# EAGLE schematic LED-Schematic (EAGLE 9.6.2)
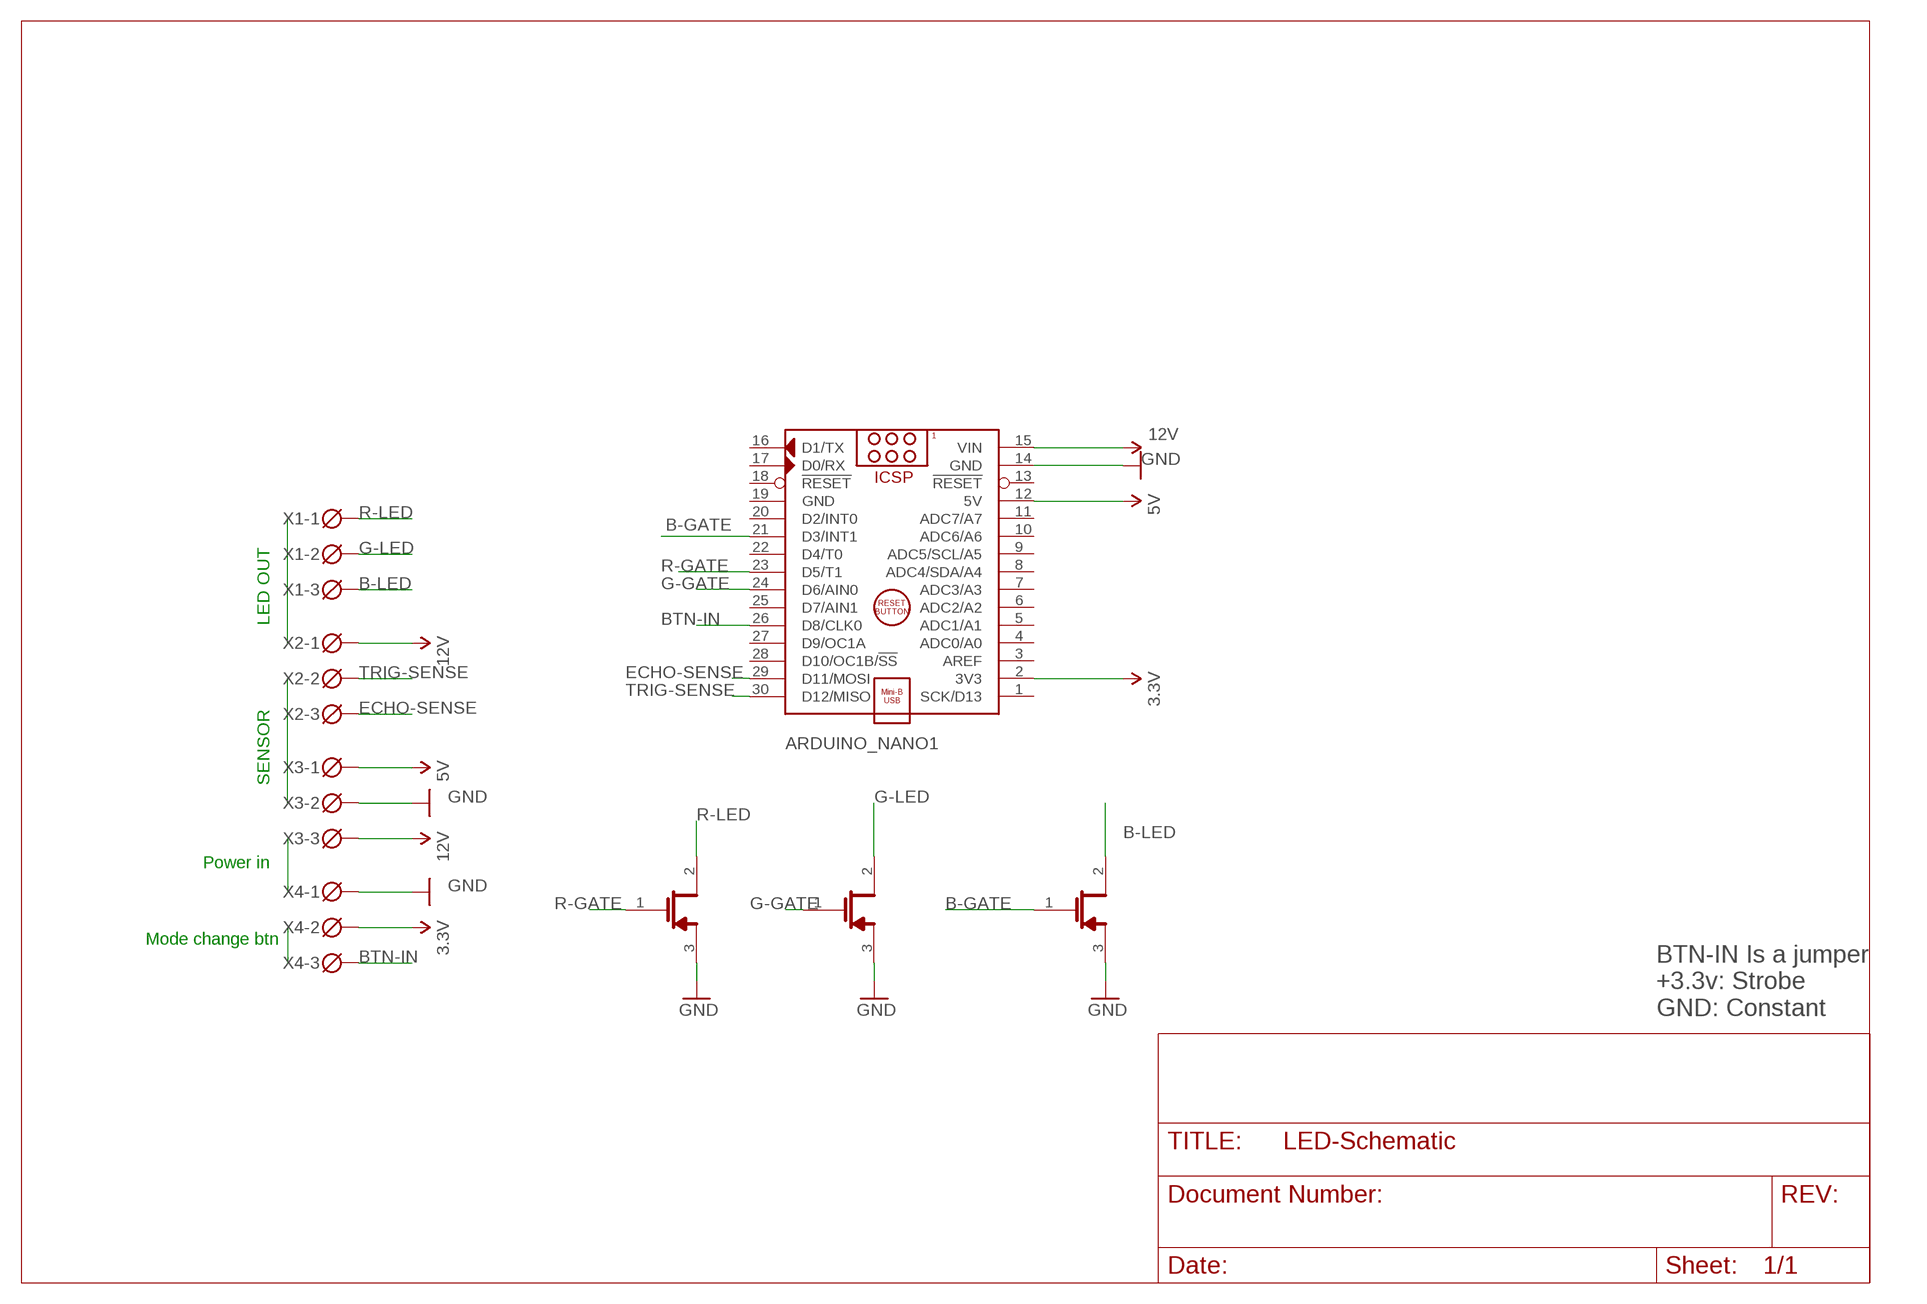
[diagram p0: schematic, sheet 1]

## Parts
ARDUINO_NANO1  ARDUINO_NANO  [ARDUINO_NANO]
Q1  INFINEON_IRLB8721PBFINFINEON_IRLB8721PBF_0_0  [INFINEON_IRLB8721PBF_0]
Q2  INFINEON_IRLB8721PBFINFINEON_IRLB8721PBF_0_0  [INFINEON_IRLB8721PBF_0]
Q3  INFINEON_IRLB8721PBFINFINEON_IRLB8721PBF_0_0  [INFINEON_IRLB8721PBF_0]
X1  DG3XX-03-3.5  [DG350-3.5-03P]
X2  DG3XX-03-3.5  [DG350-3.5-03P]
X3  DG3XX-03-3.5  [DG350-3.5-03P]
X4  DG3XX-03-3.5  [DG350-3.5-03P]

## Nets
3.3V: ARDUINO_NANO1.2(3V3) X4.2
5V: ARDUINO_NANO1.12(5V) X3.1
12V: ARDUINO_NANO1.15(VIN) X2.1 X3.3
B-GATE: ARDUINO_NANO1.21(D3/INT1) Q3.1(G)
B-LED: Q3.2(D) X1.3
BTN-IN: ARDUINO_NANO1.26(D8/CLK0) X4.3
ECHO-SENSE: ARDUINO_NANO1.29(D11/MOSI) X2.3
G-GATE: ARDUINO_NANO1.24(D6/AIN0) Q2.1(G)
G-LED: Q2.2(D) X1.2
GND: ARDUINO_NANO1.14(GND) Q1.3(S) Q2.3(S) Q3.3(S) X3.2 X4.1
R-GATE: ARDUINO_NANO1.23(D5/T1) Q1.1(G)
R-LED: Q1.2(D) X1.1
TRIG-SENSE: ARDUINO_NANO1.30(D12/MISO) X2.2
Unconnected: ARDUINO_NANO1.1(SCK/D13) ARDUINO_NANO1.3(AREF) ARDUINO_NANO1.4(ADC0/A0) ARDUINO_NANO1.5(ADC1/A1) ARDUINO_NANO1.6(ADC2/A2) ARDUINO_NANO1.7(ADC3/A3) ARDUINO_NANO1.8(ADC4/SDA/A4) ARDUINO_NANO1.9(ADC5/SCL/A5) ARDUINO_NANO1.10(ADC6/A6) ARDUINO_NANO1.11(ADC7/A7) ARDUINO_NANO1.13(!RESET) ARDUINO_NANO1.16(D1/TX) ARDUINO_NANO1.17(D0/RX) ARDUINO_NANO1.18(!RESET) ARDUINO_NANO1.20(D2/INT0) ARDUINO_NANO1.22(D4/T0) ARDUINO_NANO1.25(D7/AIN1) ARDUINO_NANO1.27(D9/OC1A) ARDUINO_NANO1.28(D10/OC1B/!SS)

## Notes on the sheet
- LED OUT
- SENSOR
- Power in
- Mode change btn
- BTN-IN Is a jumper
  +3.3v: Strobe
  GND: Constant

## Power pins joined to a net without a drawn wire
GND: ARDUINO_NANO1.19(GND)

## Library data of the parts
ARDUINO_NANO1 = ArduinoNanoV30:ARDUINO_NANO: Arduino Nano V3.0 Module Overview: The Arduino Nano is a small, complete, and breadboard-friendly board based on the ATmega328 (Arduino Nano 3.x) or ATmega168 (Arduino Nano 2.x). It has more or less the same functionality of the Arduino Duemilanove, but in a different package. It lacks only a DC power jack, and works with a Mini-B USB cable instead of a standard one. The Nano was designed and is being produced by Gravitech <http://www.gravitech.us/arna30wiatp.html>. General specifications: Item Value Microcontroller Atmel ATmega168 or ATmega328 Operating Voltage (logic level) 5 V Input Voltage (recommended) 7-12 V Input Voltage (limits) 6-20 V Digital I/O Pins 14 (of which 6 provide PWM output) Analog Input Pins 8 DC Current per I/O Pin 40 mA Flash Memory 16 KB (ATmega168) or 32 KB (ATmega328) of which 2 KB used by bootloader SRAM 1 KB (ATmega168) or 2 KB (ATmega328) EEPROM 512 bytes (ATmega168) or 1 KB (ATmega328) Clock Speed 16 MHz Dimensions (Inches) 0.73" x 1.70" Dimensions (mm) 18mm x 45mm Overall height About 9 mm (not including pins) Weigth 5 g Power: The Arduino Nano can be powered via the Mini-B USB connection, 6-20V unregulated external power supply (pin 30), or 5V regulated external power supply (pin 27). The power source is automatically selected to the highest voltage source. Memory: The ATmega168 has 16 KB of flash memory for storing code (of which 2 KB is used for the bootloader); the ATmega328 has 32 KB, (also with 2 KB used for the bootloader). The ATmega168 has 1 KB of SRAM and 512 bytes of EEPROM (which can be read and written with the EEPROM library); the ATmega328 has 2 KB of SRAM and 1 KB of EEPROM. Input and Output: Each of the 14 digital pins on the Nano can be used as an input or output, using pinMode(), digitalWrite(), and digitalRead() functions. They operate at 5 volts. Each pin can provide or receive a maximum of 40 mA and has an internal pull-up resistor (disconnected by default) of 20-50 kOhms. In addition, some pins have specialized functions. Visit Arduino - ArduinoBoardNano <https://www.arduino.cc/en/Main/ArduinoBoardNano>
Q1-Q3 = Infineon - IRLB8721PbF:INFINEON_IRLB8721PBF: High Frequency Synchronous Buck Converter; CENTROID_NOT_SPECIFIED: No; DATASHEET: https://upverter.com/datasheet/6023de1dc29e00ae136963535d37ebb95ee78d8c.pdf; DIGIKEY_DESCRIPTION: TRANS MOSFET N-CH 30V 62A TO-220AB; DIGIKEY_PART_NUMBER: IRLB8721PBF-ND; IMPORTED_FROM: octopart; IPC_LAND_PATTERN_NAME: TO-220; LEAD_FREE: yes; MF: Infineon; MOUNTING_TYPE: through hole; MOUSER_PART_NUMBER: 942-IRLB8721PBF; MPN: IRLB8721PbF; NUM_PINS: 3; PACKAGE: TO220AB-3; PREFIX: Q; ROHS: yes; SYMBOL_0_0: N-Channel Enhanced MOSFET; TEMPERATURE_RANGE_HIGH: +175°C; TEMPERATURE_RANGE_LOW: -55°C; TYPE: transistor
X1-X4 = degson:DG3XX-03: DG350-3.5-03P DG306-5.0-03P